# Altium schematic sheet T35_8_CONNECTORS.SchDoc
size A4
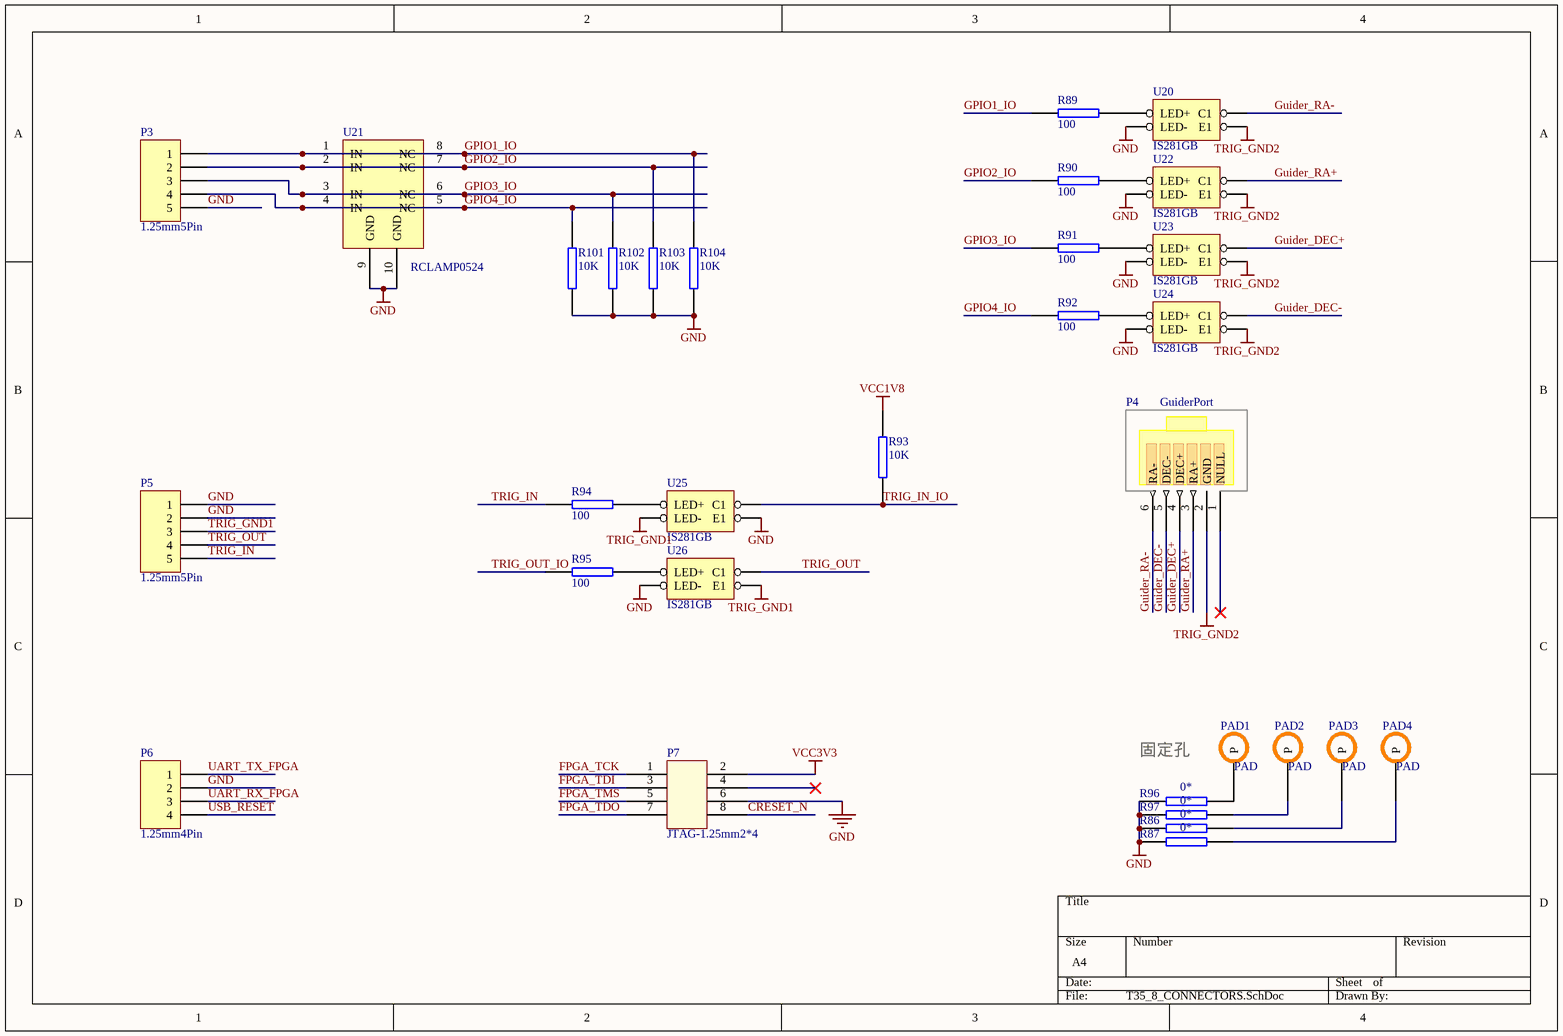
[diagram p0: T35_8_CONNECTORS.SchDoc]

## Parts
P3  1.25mm5Pin  [CC125-5]
P4  GuiderPort  [RJ11-SMD]
P5  1.25mm5Pin  [CC125-5]
P6  1.25mm4Pin  [CON_530470410_MOL]
P7  JTAG-1.25mm2*4  [MHDR2X4]
PAD1  PAD  [M2-R4-NC]
PAD2  PAD  [M2-R4-NC]
PAD3  PAD  [M1.6-R3.2-NC]
PAD4  PAD  [M1.6-R3.2-NC]
R86  0*  [0402RS]
R87  0*  [0402RS]
R89  100  [0402RS]
R90  100  [0402RS]
R91  100  [0402RS]
R92  100  [0402RS]
R93  10K  [0201RS]
R94  100  [0402RS]
R95  100  [0402RS]
R96  0*  [0402RS]
R97  0*  [0402RS]
R101  10K  [0201RS]
R102  10K  [0201RS]
R103  10K  [0201RS]
R104  10K  [0201RS]
U20  IS281GB  [TLP281-1]
U21  RCLAMP0524  [RCLAMP0524]
U22  IS281GB  [TLP281-1]
U23  IS281GB  [TLP281-1]
U24  IS281GB  [TLP281-1]
U25  IS281GB  [TLP281-1]
U26  IS281GB  [TLP281-1]

## Nets
GND: P3.5 P5.1 P5.2 P6.2 P7.6 R86.1 R87.1 R96.1 R97.1 R101.2 R102.2 R103.2 R104.2 U20.2(LED-) U21.9(GND) U21.10(GND) U22.2(LED-) U23.2(LED-) U24.2(LED-) U25.3(E1) U26.2(LED-)
TRIG_GND1: P5.3 U25.2(LED-) U26.3(E1)
TRIG_GND2: P4.2(GND) U20.3(E1) U22.3(E1) U23.3(E1) U24.3(E1)
VCC1V8: R93.1
VCC3V3: P7.2
CRESET_N: P7.8
FPGA_TCK: P7.1
FPGA_TDI: P7.3
FPGA_TDO: P7.7
FPGA_TMS: P7.5
GPIO1_IO: P3.1 R89.2 R104.1 U21.1(IN) U21.8(NC)
GPIO2_IO: P3.2 R90.2 R103.1 U21.2(IN) U21.7(NC)
GPIO3_IO: P3.3 R91.2 R102.1 U21.3(IN) U21.6(NC)
GPIO4_IO: P3.4 R92.2 R101.1 U21.4(IN) U21.5(NC)
Guider_DEC+: P4.4(DEC+) U23.4(C1)
Guider_DEC-: P4.5(DEC-) U24.4(C1)
Guider_RA+: P4.3(RA+) U22.4(C1)
Guider_RA-: P4.6(RA-) U20.4(C1)
TRIG_IN: P5.5 R94.2
TRIG_IN_IO: R93.2 U25.4(C1)
TRIG_OUT: P5.4 U26.4(C1)
TRIG_OUT_IO: R95.2
UART_RX_FPGA: P6.3
UART_TX_FPGA: P6.1
USB_RESET: P6.4
NetPAD1_1: PAD1.1(P) R96.2
NetPAD2_1: PAD2.1(P) R97.2
NetPAD3_1: PAD3.1(P) R86.2
NetPAD4_1: PAD4.1(P) R87.2
NetR89_1: R89.1 U20.1(LED+)
NetR90_1: R90.1 U22.1(LED+)
NetR91_1: R91.1 U23.1(LED+)
NetR92_1: R92.1 U24.1(LED+)
NetR94_1: R94.1 U25.1(LED+)
NetR95_1: R95.1 U26.1(LED+)

Not connected (* = marked no-connect by the designer): P4 1(NULL)*; P7 4*

## Notes on the sheet
- 固定孔

## Library data of the parts
P3 P5 = Header 5: 1.25mm间距5Pin插座; LatestRevisionDate: 17-Jul-2002; LatestRevisionNote: Re-released for DXP Platform.; Publisher: Altium Limited
P4 = GuiderPort: 导星口RJ11
P6 = Con_4: 1.25mm间距4Pin插座
P7 = 1.27mm2*4JTAGSocket: 1.25mm间距2*4 8PinJTAG烧写座; Link: https://item.szlcsc.com/3294771.html
PAD1-PAD4 = PAD: 固定孔
R86 R87 R89-R97 R101-R104 = RES2: 贴片电阻
U20 U22-U26 = TLP281_1: 光耦
  U25: ComponentLink1Description: Link; ComponentLink1URL: https://item.szlcsc.com/91059.html
U21 = RCLAMP0524: ESD保护器件